# Altium project zxRevo rev2.5.PrjPcb (part 3 of 3)

## Sheet Video out.SchDoc
size A4; SheetNumber: 13; SheetTotal: 16
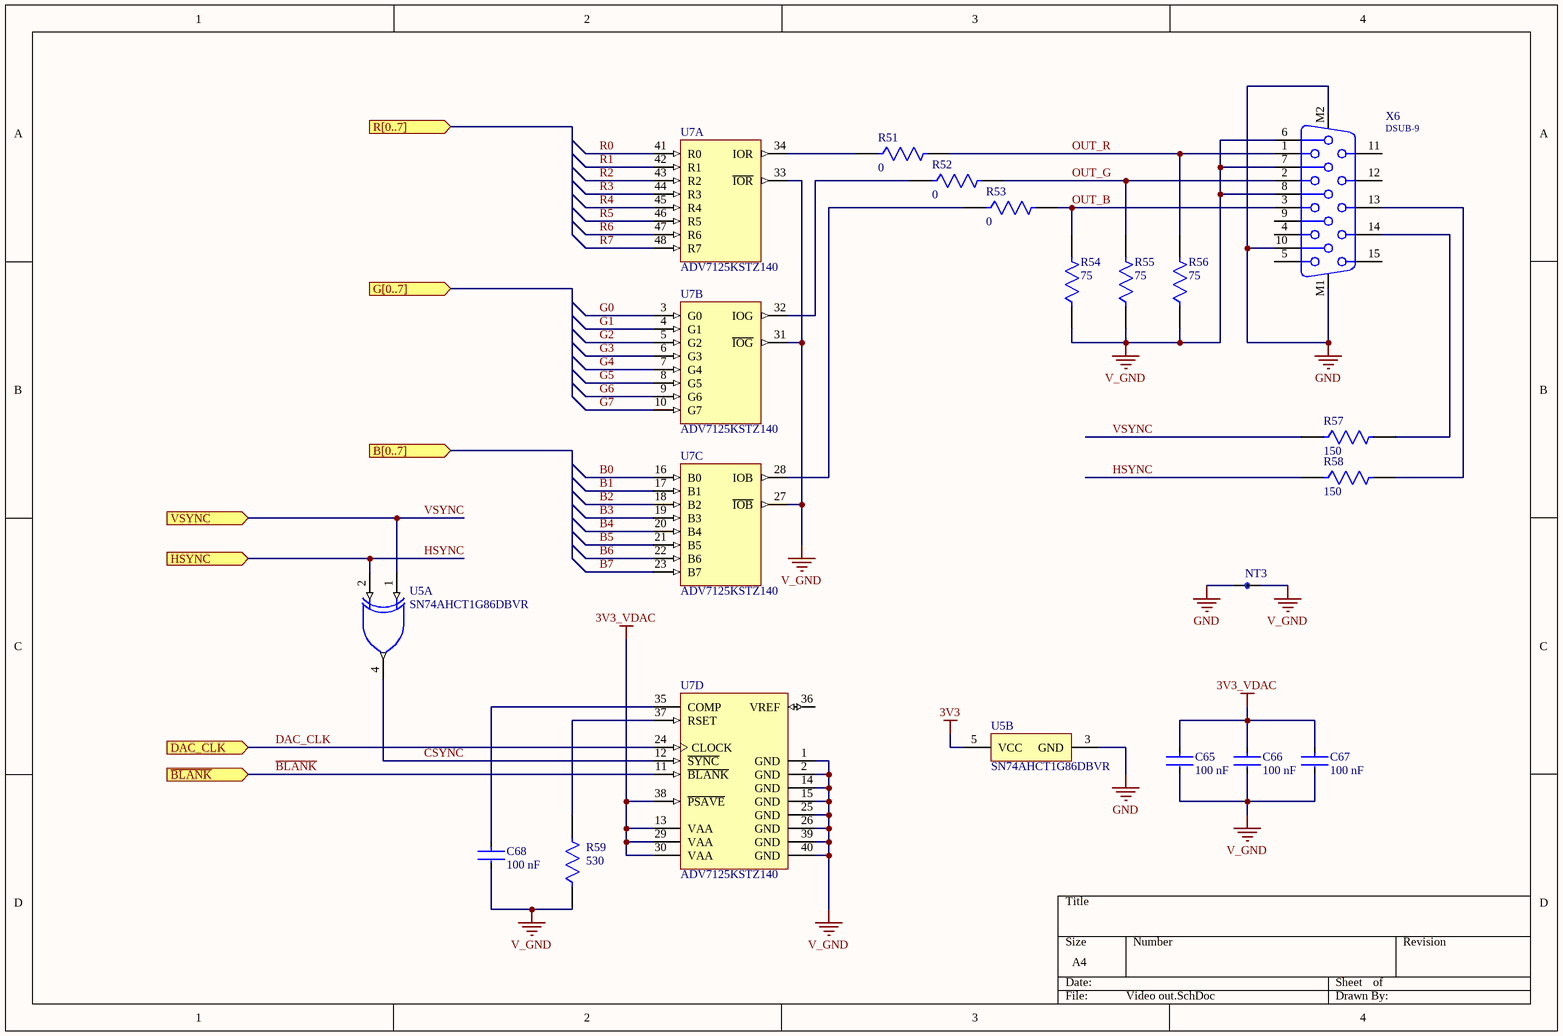
[diagram p16: Video out.SchDoc]

### Parts
C65  Capacitance: 100 nF  [CC0805]  (hidden comment: CC0805-1.5pF)
C66  Capacitance: 100 nF  [CC0805]  (hidden comment: CC0805-1.5pF)
C67  Capacitance: 100 nF  [CC0805]  (hidden comment: CC0805-1.5pF)
C68  Capacitance: 100 nF  [CC0805]  (hidden comment: CC0805-1.5pF)
NT3  net_tie  [NET_TIE]  (value not drawn)  (net tie, no BOM)
R51  Resistance: 0  [CR0805]  (hidden comment: CR0805-51)
R52  Resistance: 0  [CR0805]  (hidden comment: CR0805-51)
R53  Resistance: 0  [CR0805]  (hidden comment: CR0805-51)
R54  Resistance: 75  [CR0805]  (hidden comment: CR0805-51)
R55  Resistance: 75  [CR0805]  (hidden comment: CR0805-51)
R56  Resistance: 75  [CR0805]  (hidden comment: CR0805-51)
R57  Resistance: 150  [CR0805]  (hidden comment: CR0805-51)
R58  Resistance: 150  [CR0805]  (hidden comment: CR0805-51)
R59  Resistance: 530  [CR0805]  (hidden comment: CR0805-51)
U5  SN74AHCT1G86DBVR  [DBV0005A_L]  (parts A,B of 2)
U7  ADV7125KSTZ140  [ST-48_N]  (parts A,B,C,D of 4)
X6  DSUB-9  [618015330923]

### Ports
B[0..7] (in), DAC_CLK (in), G[0..7] (in), HSYNC (in), R[0..7] (in), VSYNC (in), ~{BLANK} (in)

### Nets
3V3: U5.5(VCC)
3V3_VDAC: C65.1 C66.1 C67.1 U7.13(VAA) U7.29(VAA) U7.30(VAA) U7.38(~{PSAVE})
GND: NT3.1 U5.3(GND) X6.10 X6.M1 X6.M2
V_GND: C65.2 C66.2 C67.2 C68.2 NT3.2 R54.1 R55.1 R56.1 R59.1 U7.1(GND) U7.2(GND) U7.14(GND) U7.15(GND) U7.25(GND) U7.26(GND) U7.27(~{IOB}) U7.31(~{IOG}) U7.33(~{IOR}) U7.39(GND) U7.40(GND) X6.6 X6.7 X6.8
B0: U7.16(B0)  [project net B0_13]
B1: U7.17(B1)  [project net B1_13]
B2: U7.18(B2)  [project net B2_13]
B3: U7.19(B3)  [project net B3_13]
B4: U7.20(B4)  [project net B4_13]
B5: U7.21(B5)  [project net B5_13]
B6: U7.22(B6)  [project net B6_13]
B7: U7.23(B7)  [project net B7_13]
~{BLANK}: U7.11(~{BLANK}) ; port ~{BLANK}
~{CSYNC}: U5.4(Y) U7.12(~{SYNC})  [project net ~{CSYNC}_13]
DAC_CLK: U7.24(CLOCK) ; port DAC_CLK
G0: U7.3(G0)  [project net G0_13]
G1: U7.4(G1)  [project net G1_13]
G2: U7.5(G2)  [project net G2_13]
G3: U7.6(G3)  [project net G3_13]
G4: U7.7(G4)  [project net G4_13]
G5: U7.8(G5)  [project net G5_13]
G6: U7.9(G6)  [project net G6_13]
G7: U7.10(G7)  [project net G7_13]
HSYNC: R58.1 U5.2(B) ; port HSYNC
OUT_B: R53.2 R54.2 X6.3  [project net OUT_B_13]
OUT_G: R52.2 R55.2 X6.2  [project net OUT_G_13]
OUT_R: R51.2 R56.2 X6.1  [project net OUT_R_13]
R0: U7.41(R0)  [project net R0_13]
R1: U7.42(R1)  [project net R1_13]
R2: U7.43(R2)  [project net R2_13]
R3: U7.44(R3)  [project net R3_13]
R4: U7.45(R4)  [project net R4_13]
R5: U7.46(R5)  [project net R5_13]
R6: U7.47(R6)  [project net R6_13]
R7: U7.48(R7)  [project net R7_13]
VSYNC: R57.1 U5.1(A) ; port VSYNC
NetC68_1: C68.1 U7.35(COMP)
NetR51_1: R51.1 U7.34(IOR)
NetR52_1: R52.1 U7.32(IOG)
NetR53_1: R53.1 U7.28(IOB)
NetR57_2: R57.2 X6.14
NetR58_2: R58.2 X6.13
NetR59_2: R59.2 U7.37(RSET)

Not connected (* = marked no-connect by the designer): U7 36(VREF); X6 4 5 9 11 12 15

### Library data of the parts
C65-C68 = CC0805: as C81-C88 on sheet USB; value: 1.5pF; Category: Cap; Case/Package: 0805
R51-R59 = CR0805: 51Ω ±0.5% 0.1W 1/10W Chip Resistor 0805 (2012 Metric) Thin Film; Manufacturer: Susumu; Manufacturer Part Number: RR1220Q-510-D; Case/Package: 0805; Number of Pins: 2; Termination: SMD/SMT; value: 51Ω; Category: Res; Number of Terminations: 2
U5 = CMP-0859-00100-3: Single 2-Input Exclusive-OR Gate, DBV0005A, LARGE T&R; Manufacturer: Texas Instruments; VCC(Max)(V): 5.5; ICC @ Nom Voltage(Max)(mA): 0.01; Gate Type: XOR; Schmitt Trigger: No; tpd @ Nom Voltage(Max)(ns): 8; Voltage(Nom)(V): 5; Logic: True; Input Type: CMOS; F @ Nom Voltage(Max)(Mhz): 75; Output Drive (IOL/IOH)(Max)(mA): 8/-8; Sub-Family: XOR Gate; Rating: Catalog; Bits(#): 1; VCC(Min)(V): 2; Technology Family: AHCT; DatasheetVersion: SCLS324M; Generic Part Number: SN74AHCT1G86; 3-State Output: No; Output Type: CMOS; Operating Temperature Range(C): -40 to 125; PackageReference: DBV0005A
U7 = ADV7125KSTZ140: 3 Channel 8-Bit CMOS High Speed Video Digital-to-Analog Converter, -40 to +85 degC, ST-48, Pb-Free, Tray; Manufacturer: Analog Devices; PackageDescription: 48-Pin Thin Quad Flat Pack 0.5 mm Pitch; PartNumber: ADV7125KSTZ140; Manufacturer Part Number: ADV7125KSTZ140; value: ADV7125KSTZ140; Case/Package: TQFP-48; Category: IC
X6 = DSUB-9: Female High Density PCB Connector with Hex Screw WR-DSUB, Angled, 15 pins; Manufacturer: Wurth Electronics; Manufacturer Part Number: 618015330923; value: DSUB, Angled, 15 pins; Case/Package: DSUB-15; Category: Connector

## Sheet Sheet1.SchDoc
size A4; SheetNumber: 16; SheetTotal: 16
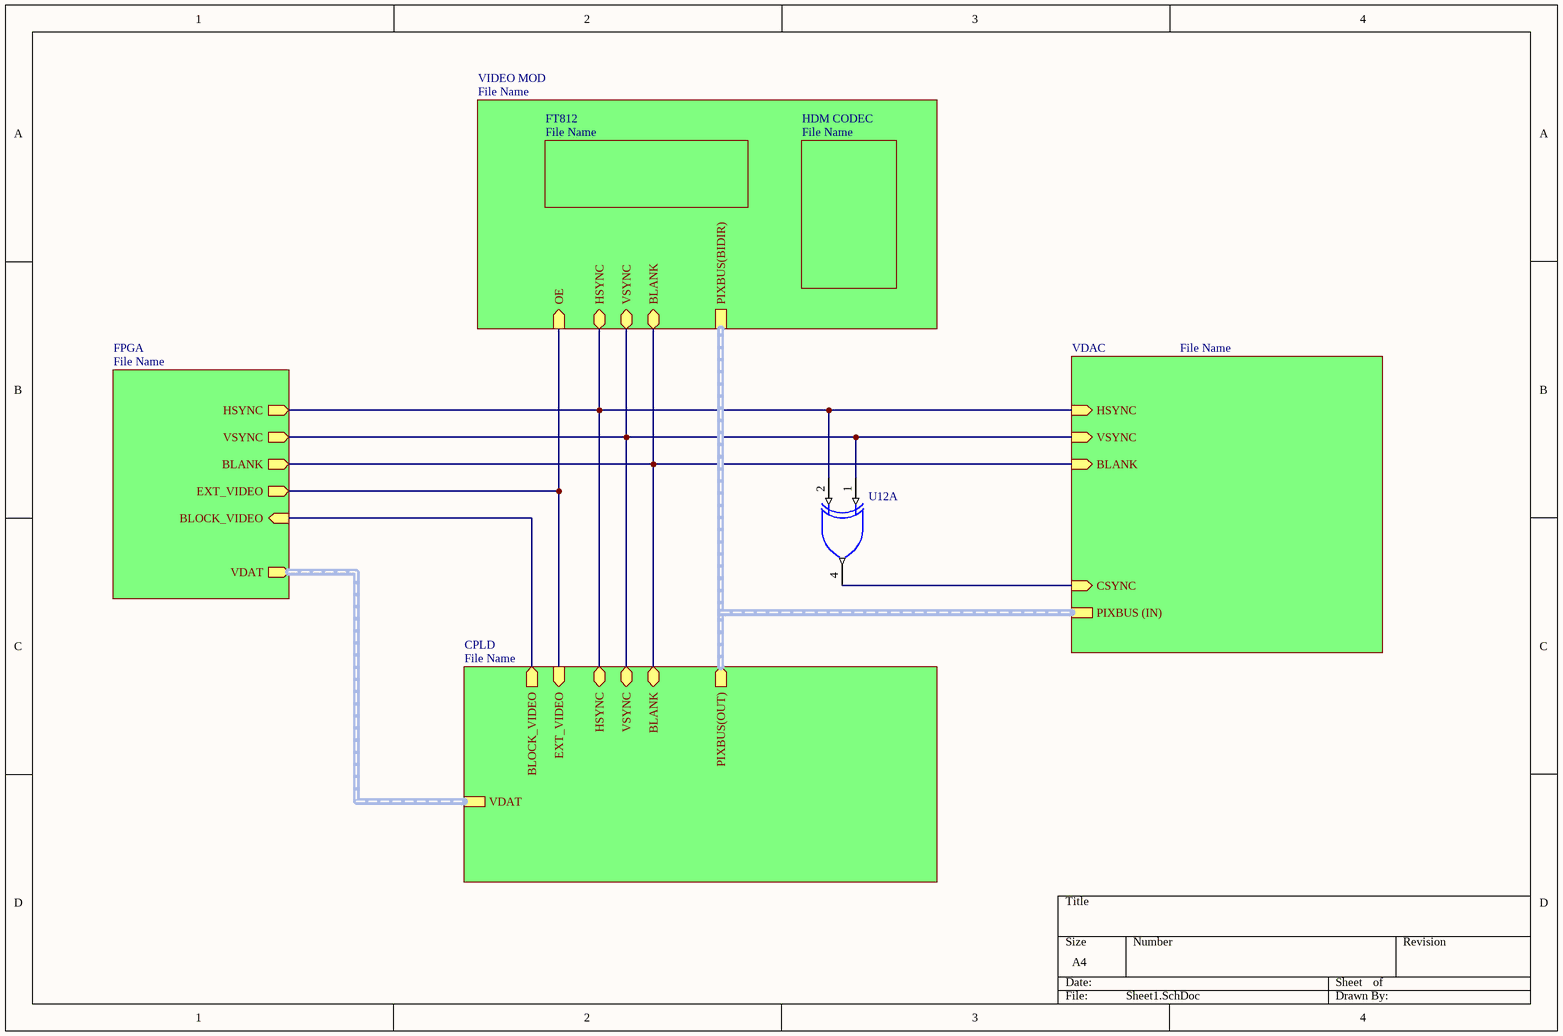
[diagram p17: Sheet1.SchDoc]

### Parts
U12  SN74AHCT1G86DBVR  [DBV0005A_L]  (value not drawn)  (part A of 2)

### Sub-sheets
CPLD = File Name (file not in this document): HSYNC (bidir), VSYNC (bidir), BLANK (bidir), EXT_VIDEO (in), VDAT, PIXBUS(OUT) (out, harness SPI), BLOCK_VIDEO (out)
FPGA = File Name (file not in this document): HSYNC (out), VSYNC (out), BLANK (out), EXT_VIDEO (out), VDAT (out), BLOCK_VIDEO (in)
FT812 = File Name (file not in this document): no entries
HDM CODEC = File Name (file not in this document): no entries
VDAC = File Name (file not in this document): HSYNC (in), VSYNC (in), BLANK (in), CSYNC (in), PIXBUS (IN)
VIDEO MOD = File Name (file not in this document): HSYNC (bidir), VSYNC (bidir), BLANK (bidir), OE (in), PIXBUS(BIDIR)

### Nets
NetU12_1: U12.1(A) ; sheet FPGA/VSYNC, sheet VIDEO MOD/VSYNC, sheet CPLD/VSYNC, sheet VDAC/VSYNC
NetU12_2: U12.2(B) ; sheet FPGA/HSYNC, sheet VIDEO MOD/HSYNC, sheet CPLD/HSYNC, sheet VDAC/HSYNC
NetU12_4: U12.4(Y) ; sheet VDAC/CSYNC
(unnamed): sheet FPGA/BLANK, sheet VIDEO MOD/BLANK, sheet CPLD/BLANK, sheet VDAC/BLANK
(unnamed): sheet FPGA/EXT_VIDEO, sheet VIDEO MOD/OE, sheet CPLD/EXT_VIDEO
(unnamed): sheet FPGA/BLOCK_VIDEO, sheet CPLD/BLOCK_VIDEO

### Buses and harness runs
harness sheet CPLD/PIXBUS(OUT) = sheet VDAC/PIXBUS (IN) = sheet VIDEO MOD/PIXBUS(BIDIR)
harness sheet CPLD/VDAT = sheet FPGA/VDAT

### Library data of the parts
U12 = CMP-0859-00100-3: as U5 on sheet Video out; DatasheetVersion: SCLS324M; Generic Part Number: SN74AHCT1G86; 3-State Output: No; Output Type: CMOS; Operating Temperature Range(C): -40 to 125; PackageReference: DBV0005A

## Nets that join several sheets
2V5: TOP (12 pins), Power ATX (10 pins)
3V3: TOP (28 pins), CPLD (16 pins), SDCARD (C116.1 L9.1), Power ATX (16 pins), ESP32 (14 pins), AY Amp (10 pins), PLL (FB1.1), Video out (U5.5)
3V3_VDAC: Power ATX (C29.1 C30.2 L4.2), Video out (7 pins)
5V0: TOP (6 pins), Memory (12 pins), CPU ROM (13 pins), BUS (10 pins), FDC (17 pins), Power ATX (17 pins), USB (13 pins), ESP32 (9 pins), AY Amp (C58.1 L8.1), Gamepads (7 pins)
A5V0: AY Amp (14 pins), Tape (D3.8)
AGND: AY Amp (30 pins), Tape (8 pins)
GND: TOP (39 pins), Memory (12 pins), CPU ROM (5 pins), BUS (18 pins), FDC (28 pins), CPLD (16 pins), SDCARD (18 pins), Power ATX (52 pins), USB (25 pins), ESP32 (21 pins), AY Amp (8 pins), PLL (5 pins), Gamepads (16 pins), Video out (5 pins)
STB_3V3: TOP (J2.5), Power ATX (C15.2 C16.1 L1.2 R2.2), USB (C81.1 D11.4 D11.16), ESP32 (5 pins)
VCC12: BUS (C93.1 J9.0), Power ATX (PWR1.10)
VG93_12V: FDC (C69.2 D8.40), Power ATX (R5.1 VD1.3)
/HARD_RES: TOP (J2.1), ESP32 (C106.2 D16.3 Q4.3 R80.8)
/SOFT_RES: TOP (J2.3), ESP32 (C107.2 D16.27 Q5.3 R80.7)
A0: TOP (D1.44), CPU ROM (D12.27 D13.12), BUS (XS1.A9 XS2.A9)
A1: TOP (D1.41), CPU ROM (D12.28 D13.11), BUS (XS1.A10 XS2.A10)
A2: TOP (D1.40), CPU ROM (D12.29 D13.10), BUS (XS1.A11 XS2.A11)
A3: TOP (D1.39), CPU ROM (D12.30 D13.9), BUS (XS1.A12 XS2.A12)
A4: TOP (D1.38), CPU ROM (D12.31 D13.8), BUS (XS1.A24 XS2.A24)
A5: TOP (D1.37), CPU ROM (D12.32 D13.7), BUS (XS1.A23 XS2.A23), FDC (D8.5)
A6: TOP (D1.36), CPU ROM (D12.34 D13.6), BUS (XS1.A22 XS2.A22), FDC (D8.6)
A7: TOP (D1.31), CPU ROM (D12.35 D13.5), BUS (XS1.A21 XS2.A21)
A8: TOP (D1.30), CPU ROM (D12.36 D13.27), BUS (XS1.B26 XS2.B26)
A9: TOP (D1.29), CPU ROM (D12.37 D13.26), BUS (XS1.A27 XS2.A27)
A10: TOP (D1.28), CPU ROM (D12.38 D13.23), BUS (XS1.B27 XS2.B27)
A11: TOP (D1.27), CPU ROM (D12.40 D13.25), BUS (XS1.A28 XS2.A28)
A12: TOP (D1.26), CPU ROM (D12.41 D13.4), BUS (XS1.A2 XS2.A2)
A13: TOP (D1.25), CPU ROM (D12.42 D13.28), BUS (XS1.B2 XS2.B2)
A14: TOP (D1.24), CPU ROM (D12.43), BUS (XS1.A1 XS2.A1)
A15: TOP (D1.19), CPU ROM (D12.44), BUS (XS1.B1 XS2.B1)
AC97_CLK: AY Amp (D4.11), PLL (R94.2)
ADCDAT: TOP (J3.28), ESP32 (R75.1), AY Amp (D4.16)
ATX_POWERON: Power ATX (VT1.1), ESP32 (R77.2)
AY_BC1: TOP (D1.136), AY Amp (D6.29 J6.24)
AY_BDIR: TOP (D1.135), AY Amp (D6.27 J6.28)
AY_CLK: AY Amp (D6.22 J6.38), PLL (R95.2)
~{BLANK}: TOP (D1.100 J3.8 R102.2), CPLD (U11.99), Video out (U7.11)
~{BUSA}: CPU ROM (D12.20), BUS (XS1.A26 XS2.A26)
~{BUSR}: CPU ROM (D12.22 R73.1), BUS (XS1.A19 XS2.A19)
BCLK: TOP (J3.24), ESP32 (R81.1), AY Amp (D4.12)
BEEP: TOP (D1.133 R13.1), AY Amp (R49.2)
~{CONFIG}: TOP (D1.105), ESP32 (D16.22 R87.3)
~{CPLD_SSEL}: CPLD (U11.73), ESP32 (D16.15 R76.2)
~{CSROM}: TOP (D2.6), BUS (R71.2 XS1.A25 XS2.A25)
CLKZ: TOP (R15.2), CPU ROM (D12.1)
CONFDONE: TOP (D1.2), ESP32 (D16.17 R87.2)
D0: TOP (D1.18), CPU ROM (D12.9 D13.13), BUS (XS1.B6 XS2.B6), FDC (D8.7), AY Amp (D6.37 J6.8 U6.11)
D1: TOP (D1.17), CPU ROM (D12.10 D13.14), BUS (XS1.B7 XS2.B7), FDC (D8.8), AY Amp (D6.36 J6.10 U6.10)
D2: TOP (D1.16), CPU ROM (D12.7 D13.15), BUS (XS1.B8 XS2.B8), FDC (D8.9), AY Amp (D6.35 J6.12 U6.9)
D3: TOP (D1.15), CPU ROM (D12.3 D13.17), BUS (XS1.B11 XS2.B11), FDC (D8.10), AY Amp (D6.34 J6.14 U6.8)
D4: TOP (D1.14), CPU ROM (D12.2 D13.18), BUS (XS1.B12 XS2.B12), FDC (D8.11), AY Amp (D6.33 J6.16 U6.7)
D5: TOP (D1.13), CPU ROM (D12.4 D13.19), BUS (XS1.B10 XS2.B10), FDC (D8.12), AY Amp (D6.32 J6.18 U6.6)
D6: TOP (D1.12), CPU ROM (D12.5 D13.20), BUS (XS1.B9 XS2.B9), FDC (D8.13), AY Amp (D6.31 J6.20 U6.5)
D7: TOP (D1.11), CPU ROM (D12.8 D13.21), BUS (XS1.B3 XS2.B3), FDC (D8.14), AY Amp (D6.30 J6.22 U6.4)
~{DOS}: TOP (D1.160), CPU ROM (D13.3), BUS (XS1.A4 XS2.A4)
DAC_B0: TOP (J3.38), CPLD (U11.21)
DAC_B1: TOP (J3.40), CPLD (U11.20)
DAC_B2: TOP (J3.42), CPLD (U11.19)
DAC_B3: TOP (J3.44), CPLD (U11.18)
DAC_B4: TOP (J3.46), CPLD (U11.17)
DAC_B5: TOP (J3.48), CPLD (U11.16)
DAC_B6: TOP (J3.50), CPLD (U11.15)
DAC_B7: TOP (J3.52), CPLD (U11.14)
DAC_CLK: TOP (D1.103 J3.49), CPLD (U11.12), Video out (U7.24)
DAC_G0: TOP (J3.33), CPLD (U11.35)
DAC_G1: TOP (J3.35), CPLD (U11.34)
DAC_G2: TOP (J3.37), CPLD (U11.33)
DAC_G3: TOP (J3.39), CPLD (U11.30)
DAC_G4: TOP (J3.41), CPLD (U11.29)
DAC_G5: TOP (J3.43), CPLD (U11.28)
DAC_G6: TOP (J3.45), CPLD (U11.27)
DAC_G7: TOP (J3.47), CPLD (U11.26)
DAC_R0: TOP (J3.17), CPLD (U11.43)
DAC_R1: TOP (J3.19), CPLD (U11.42)
DAC_R2: TOP (J3.21), CPLD (U11.41)
DAC_R3: TOP (J3.23), CPLD (U11.40)
DAC_R4: TOP (J3.25), CPLD (U11.39)
DAC_R5: TOP (J3.27), CPLD (U11.38)
DAC_R6: TOP (J3.29), CPLD (U11.37)
DAC_R7: TOP (J3.31), CPLD (U11.36)
DACDAT: ESP32 (R78.1), AY Amp (D4.14)
DACLRC: TOP (J3.26), ESP32 (R79.1), AY Amp (D4.13)
DATA0: TOP (D1.156), ESP32 (D16.11)
DCLK: TOP (D1.155), ESP32 (D16.10 R87.4)
DTR: USB (D11.13), ESP32 (Q5.2 R80.3)
~{EXT_VIDEO}: TOP (D1.101 J3.22 R98.2), CPLD (U11.62)
ESP32_MASTER.MISO: CPLD (U11.83), ESP32 (D16.28 R85.2)
ESP32_MASTER.MOSI: CPLD (U11.81), ESP32 (D16.30 R88.2)
ESP32_MASTER.~{SSEL}: CPLD (U11.78), ESP32 (D16.31 R86.2)
ESP32_MASTER.SCLK: CPLD (U11.82), ESP32 (D16.29 R84.2)
ESP32_RXD: USB (D11.2), ESP32 (D16.36)
ESP32_SLAVE.MISO: CPLD (U11.86), ESP32 (D16.19)
ESP32_SLAVE.MOSI: CPLD (U11.84), ESP32 (D16.21)
ESP32_SLAVE.~{SSEL}: CPLD (U11.87), ESP32 (D16.18)
ESP32_SLAVE.SCLK: CPLD (U11.85), ESP32 (D16.20)
ESP32_TXD: USB (D11.3), ESP32 (D16.37)
ESP_LED: TOP (J2.6), Gamepads (R74.1)
FPGA_CLK: TOP (D1.183), PLL (R93.2)
FPGA_SEL0: TOP (D1.97), CPLD (U11.74)
FPGA_SEL1: TOP (D1.99), CPLD (U11.75)
~{HALT}: CPU ROM (D12.14), BUS (XS1.B15 XS2.B15)
HSYNC: TOP (D1.111 J3.6 R100.2), CPLD (U11.51), Video out (R58.1 U5.2)
I2C.SCL: TOP (J3.30 X1.3), ESP32 (D16.38 R82.2), AY Amp (D4.17), PLL (D17.4), Gamepads (U9.14 U10.14)
I2C.SDA: TOP (J3.32 X1.2), ESP32 (D16.39 R83.2), AY Amp (D4.18), PLL (D17.5), Gamepads (U9.15 U10.15)
~{INT}: TOP (D1.10), CPU ROM (D12.12 R72.4), BUS (XS1.B13 XS2.B13)
~{IORQ}: TOP (D1.7), CPU ROM (D12.16 R72.1)
~{IORQ1}: TOP (D1.148), BUS (XS1.B17)
~{IORQ2}: TOP (D1.149), BUS (XS1.B31 XS2.B17)
IORQGE1: TOP (D1.78), BUS (R69.2 XS1.A13)
IORQGE2: TOP (D1.80), BUS (R70.2 XS1.A31 XS2.A13)
~{M1}: TOP (D1.144), CPU ROM (D12.24), BUS (XS1.B24 XS2.B24)
~{MREQ}: TOP (D1.8), CPU ROM (D12.15 R72.2), BUS (XS1.B16 XS2.B16)
MISO: TOP (J3.12), CPLD (U11.2)
MOSI: TOP (J3.14), CPLD (U11.3)
~{NMI}: TOP (D1.9), CPU ROM (D12.13 R72.3), BUS (XS1.B14 XS2.B14)
~{RD}: TOP (D1.141), CPU ROM (D12.18 R73.4), BUS (XS1.B18 XS2.B18), FDC (D8.4)
~{RDROM}: CPU ROM (D13.22), BUS (R71.1 XS1.A15 XS2.A15)
~{RES}: TOP (R22.2), CPU ROM (D12.23), BUS (XS1.A20 XS2.A20), AY Amp (D6.23 J6.36)
~{RFSH}: TOP (D1.147), CPU ROM (D12.25), BUS (XS1.B25 XS2.B25)
~{RLCAS}: TOP (R10.2), Memory (RAM1.31 RAM2.31)
~{ROMOE}: TOP (D1.167), CPU ROM (D13.24)
~{ROMWE}: TOP (D1.166), CPU ROM (D13.31)
~{RRAS0}: TOP (R9.2), Memory (RAM1.14)
~{RRAS1}: TOP (R12.2), Memory (RAM2.14)
~{RUCAS}: TOP (R11.2), Memory (RAM1.29 RAM1.30 RAM2.29 RAM2.30)
~{RWE}: TOP (D1.187), Memory (RAM1.13 RAM2.13)
RA0: TOP (D1.177), Memory (RAM1.17 RAM2.17)
RA1: TOP (D1.175), Memory (RAM1.18 RAM2.18)
RA2: TOP (D1.173), Memory (RAM1.19 RAM2.19)
RA3: TOP (D1.170), Memory (RAM1.20 RAM2.20)
RA4: TOP (D1.169), Memory (RAM1.23 RAM2.23)
RA5: TOP (D1.172), Memory (RAM1.24 RAM2.24)
RA6: TOP (D1.174), Memory (RAM1.25 RAM2.25)
RA7: TOP (D1.176), Memory (RAM1.26 RAM2.26)
RA8: TOP (D1.179), Memory (RAM1.27 RAM2.27)
RA9: TOP (D1.180), Memory (RAM1.28 RAM2.28)
RD0: TOP (D1.208), Memory (RAM1.2 RAM2.2)
RD1: TOP (D1.206), Memory (RAM1.3 RAM2.3)
RD2: TOP (D1.204), Memory (RAM1.4 RAM2.4)
RD3: TOP (D1.202), Memory (RAM1.5 RAM2.5)
RD4: TOP (D1.199), Memory (RAM1.7 RAM2.7)
RD5: TOP (D1.197), Memory (RAM1.8 RAM2.8)
RD6: TOP (D1.195), Memory (RAM1.9 RAM2.9)
RD7: TOP (D1.192), Memory (RAM1.10 RAM2.10)
RD8: TOP (D1.191), Memory (RAM1.33 RAM2.33)
RD9: TOP (D1.193), Memory (RAM1.34 RAM2.34)
RD10: TOP (D1.196), Memory (RAM1.35 RAM2.35)
RD11: TOP (D1.198), Memory (RAM1.36 RAM2.36)
RD12: TOP (D1.200), Memory (RAM1.38 RAM2.38)
RD13: TOP (D1.203), Memory (RAM1.39 RAM2.39)
RD14: TOP (D1.205), Memory (RAM1.40 RAM2.40)
RD15: TOP (D1.207), Memory (RAM1.41 RAM2.41)
ROMPG2: TOP (D1.164), CPU ROM (D13.2)
ROMPG3: TOP (D1.163), CPU ROM (D13.30)
ROMPG4: TOP (D1.162), CPU ROM (D13.1)
RS: TOP (R17.2), CPU ROM (D13.29), BUS (XS1.A16 XS2.A16)
RTS: USB (D11.14), ESP32 (Q4.2 R80.4)
~{SD0_SSEL}: CPLD (U11.92), SDCARD (CD1.2)
~{SD1_SSEL}: CPLD (U11.88), SDCARD (CD2.2 X20.1)
~{SOFTRST}: CPLD (U11.4), USB (U8.17)
~{SPI_SLAVE_IRQ}: TOP (D1.159), ESP32 (D16.25)
~{SPI_SLAVE_SSEL}: TOP (D1.182), CPLD (U11.5)
~{STATUS}: TOP (D1.52), ESP32 (D16.12 R87.1)
SCLK: TOP (J3.10), CPLD (U11.1)
SD0_MISO: CPLD (U11.97), SDCARD (CD1.7 R91.3)
SD0_MOSI: CPLD (U11.95), SDCARD (CD1.3)
SD0_SCLK: CPLD (U11.96), SDCARD (CD1.5)
SD1_MISO: CPLD (U11.91), SDCARD (CD2.7 R92.3 X20.6)
SD1_MOSI: CPLD (U11.89), SDCARD (CD2.3 X20.2)
SD1_SCLK: CPLD (U11.90), SDCARD (CD2.5 X20.4)
SPI_EXT.~{SSEL}: TOP (J3.16), CPLD (U11.100)
SPI_HOST.MISO: TOP (D1.115), CPLD (U11.48)
SPI_HOST.MOSI: TOP (D1.116), CPLD (U11.47)
SPI_HOST.~{SSEL}: TOP (D1.119), CPLD (U11.44)
SPI_HOST.SCLK: TOP (D1.114), CPLD (U11.49)
SPI_SLAVE.MISO: TOP (D1.158), CPLD (U11.8)
SPI_SLAVE.MOSI: TOP (D1.157), CPLD (U11.7)
SPI_SLAVE.SCLK: TOP (D1.184), CPLD (U11.6)
STEP: TOP (D1.46), FDC (D8.15 D9.5)
TAPE_BIT: ESP32 (D16.23), Tape (D3.1 R28.1)
TAPE_IN: AY Amp (P2.1), Tape (C34.1 J4.2 R29.2 X3.1)
TAPE_OUT_BIT: TOP (D1.134), Tape (R24.2)
TCK_FPGA: TOP (D1.1 R23.2 X2.1), CPLD (U11.24)
TDO_CPLD: TOP (X2.3), CPLD (U11.25)
TDO_FPGA: TOP (D1.4), CPLD (U11.23)
TMS_FPGA: TOP (D1.50 R19.2 X2.5), CPLD (U11.22)
USB_n: USB (R96.1), ESP32 (D16.13 X14.1)
USB_p: USB (R97.1), ESP32 (D16.14 X14.2)
~{VG_CS}: TOP (D1.45), FDC (D8.3 R64.1)
~{VG_RES}: TOP (D1.54), FDC (D8.19 D10.3 R66.2)
VDAT0: TOP (D1.96), CPLD (U11.52)
VDAT1: TOP (D1.94), CPLD (U11.54)
VDAT2: TOP (D1.92), CPLD (U11.56)
VDAT3: TOP (D1.89), CPLD (U11.58)
VDAT4: TOP (D1.87), CPLD (U11.64)
VDAT5: TOP (D1.85), CPLD (U11.67)
VDAT6: TOP (D1.75), CPLD (U11.69)
VDAT7: TOP (D1.73), CPLD (U11.71)
VDAT8: TOP (D1.71), CPLD (U11.72)
VDAT9: TOP (D1.74), CPLD (U11.70)
VDAT10: TOP (D1.83), CPLD (U11.68)
VDAT11: TOP (D1.86), CPLD (U11.66)
VDAT12: TOP (D1.88), CPLD (U11.61)
VDAT13: TOP (D1.90), CPLD (U11.57)
VDAT14: TOP (D1.93), CPLD (U11.55)
VDAT15: TOP (D1.95), CPLD (U11.53)
VG_A0: TOP (D1.69), FDC (D10.1)
VG_A1: TOP (D1.70), FDC (D10.2)
VG_CLK: TOP (D1.56), FDC (D8.24)
VG_DRQ: TOP (D1.63), FDC (D8.38 R64.3)
VG_HRDY: TOP (D1.55), FDC (D7.13 D8.23)
VG_IRQ: TOP (D1.64), FDC (D8.39 R64.2)
VG_RAWR: TOP (D1.58), FDC (D8.27)
VG_RCLK: TOP (D1.57), FDC (D8.26)
VG_SIDE: TOP (D1.65), FDC (D9.11)
VG_SL: TOP (D1.47), FDC (D8.17)
VG_SR: TOP (D1.53), FDC (D8.18)
VG_TR43: TOP (D1.60), FDC (D8.29)
VG_WD: TOP (D1.61), FDC (D8.31)
VG_WRD: TOP (D1.67), FDC (D9.9)
VSYNC: TOP (D1.112 J3.4 R101.2), CPLD (U11.50), Video out (R57.1 U5.1)
~{WAIT}: TOP (D1.143), CPU ROM (D12.21 R73.2), BUS (XS1.B21 XS2.B21)
~{WR}: TOP (D1.140), CPU ROM (D12.19 R73.3), BUS (XS1.B19 XS2.B19), FDC (D8.2)
WRDAC: TOP (D1.113), AY Amp (U6.13)